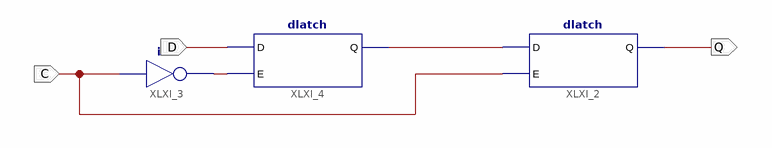
[diagram p0: schematic sheet 1]
// Xilinx ISE schematic flipflop.sch (spartan6) as structural Verilog: 3 symbols, 3 ports
module flipflop (
  input  D,
  input  C,
  output Q
);

  wire XLXN_2, XLXN_5;

  dlatch XLXI_2 (.D(XLXN_2), .E(C), .Q(Q));
  not XLXI_3 (XLXN_5, C);
  dlatch XLXI_4 (.D(D), .E(XLXN_5), .Q(XLXN_2));
endmodule
